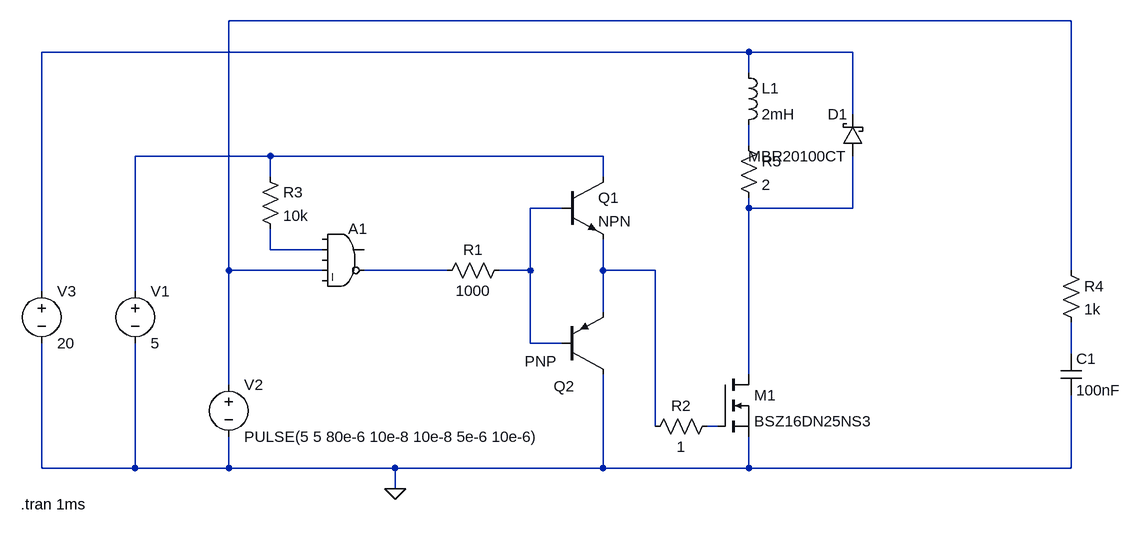
[diagram p0: schematic OpenCollectorDriver.asc]
OpenCollectorDriver.asc, the LTspice schematic file:
Version 4
SHEET 1 1048 680
WIRE 784 -224 -512 -224
WIRE 288 -176 -800 -176
WIRE 448 -176 288 -176
WIRE 288 -144 288 -176
WIRE 448 -80 448 -176
WIRE 288 -32 288 -64
WIRE -448 -16 -656 -16
WIRE 64 -16 -448 -16
WIRE -448 16 -448 -16
WIRE 64 16 64 -16
WIRE 0 64 -48 64
WIRE 288 64 288 48
WIRE 448 64 448 -16
WIRE 448 64 288 64
WIRE -448 128 -448 96
WIRE -368 128 -448 128
WIRE -512 160 -512 -224
WIRE -368 160 -512 160
WIRE -176 160 -304 160
WIRE -48 160 -48 64
WIRE -48 160 -96 160
WIRE 64 160 64 112
WIRE 144 160 64 160
WIRE 784 160 784 -224
WIRE -800 192 -800 -176
WIRE -656 192 -656 -16
WIRE 64 224 64 160
WIRE -48 272 -48 160
WIRE 0 272 -48 272
WIRE 784 288 784 240
WIRE 288 320 288 64
WIRE -512 336 -512 160
WIRE 144 400 144 160
WIRE 240 400 224 400
WIRE -800 464 -800 272
WIRE -656 464 -656 272
WIRE -656 464 -800 464
WIRE -512 464 -512 416
WIRE -512 464 -656 464
WIRE -256 464 -512 464
WIRE 64 464 64 320
WIRE 64 464 -256 464
WIRE 288 464 288 416
WIRE 288 464 64 464
WIRE 784 464 784 352
WIRE 784 464 288 464
WIRE -256 496 -256 464
FLAG -256 496 0
SYMBOL voltage -512 320 R0
WINDOW 123 0 0 Left 0
WINDOW 39 0 0 Left 0
SYMATTR InstName V2
SYMATTR Value PULSE(5 5 80e-6 10e-8 10e-8 5e-6 10e-6)
SYMBOL nmos 240 320 R0
SYMATTR InstName M1
SYMATTR Value BSZ16DN25NS3
SYMBOL voltage -800 176 R0
WINDOW 123 0 0 Left 0
WINDOW 39 0 0 Left 0
SYMATTR InstName V3
SYMATTR Value 20
SYMBOL res 272 -48 R0
SYMATTR InstName R5
SYMATTR Value 2
SYMBOL ind 272 -160 R0
SYMATTR InstName L1
SYMATTR Value 2mH
SYMBOL schottky 464 -16 R180
WINDOW 0 24 64 Left 2
WINDOW 3 24 0 Left 2
SYMATTR InstName D1
SYMATTR Value MBR20100CT
SYMATTR Description Diode
SYMATTR Type diode
SYMBOL voltage -656 176 R0
WINDOW 123 0 0 Left 0
WINDOW 39 0 0 Left 0
SYMATTR InstName V1
SYMATTR Value 5
SYMBOL res -80 144 R90
WINDOW 0 0 56 VBottom 2
WINDOW 3 32 56 VTop 2
SYMATTR InstName R1
SYMATTR Value 1000
SYMBOL res 240 384 R90
WINDOW 0 0 56 VBottom 2
WINDOW 3 32 56 VTop 2
SYMATTR InstName R2
SYMATTR Value 1
SYMBOL npn 0 16 R0
SYMATTR InstName Q1
SYMBOL pnp 0 320 M180
WINDOW 0 -12 -18 Left 2
WINDOW 3 -57 20 Left 2
SYMATTR InstName Q2
SYMBOL Digital\\and -336 80 R0
SYMATTR InstName A1
SYMATTR SpiceLine Vhigh=5V
SYMBOL res -464 0 R0
SYMATTR InstName R3
SYMATTR Value 10k
SYMBOL res 768 144 R0
SYMATTR InstName R4
SYMATTR Value 1k
SYMBOL cap 768 288 R0
SYMATTR InstName C1
SYMATTR Value 100nF
TEXT -832 520 Left 2 !.tran 1ms

The netlist it stands for:
* OpenCollectorDriver.asc
V2 N001 0 PULSE(5 5 80e-6 10e-8 10e-8 5e-6 10e-6)
M1 N006 N011 0 0 BSZ16DN25NS3
V3 N002 0 20
R5 N003 N006 2
L1 N002 N003 2mH
D1 N006 N002 MBR20100CT
V1 N004 0 5
R1 N005 N008 1000
R2 N011 N009 1
Q1 N004 N005 N009 0 NPN
Q2 0 N005 N009 0 PNP
A1 0 N007 0 N001 0 N008 0 0 AND Vhigh=5V
R3 N004 N007 10k
R4 N001 N010 1k
C1 N010 0 100nF
.model D D
.lib standard.dio
.model NPN NPN
.model PNP PNP
.lib standard.bjt
.model NMOS NMOS
.model PMOS PMOS
.lib standard.mos
.tran 1ms
.backanno
.end